# EAGLE design brushless (EAGLE 6.1)

## Sheet 1 of 5
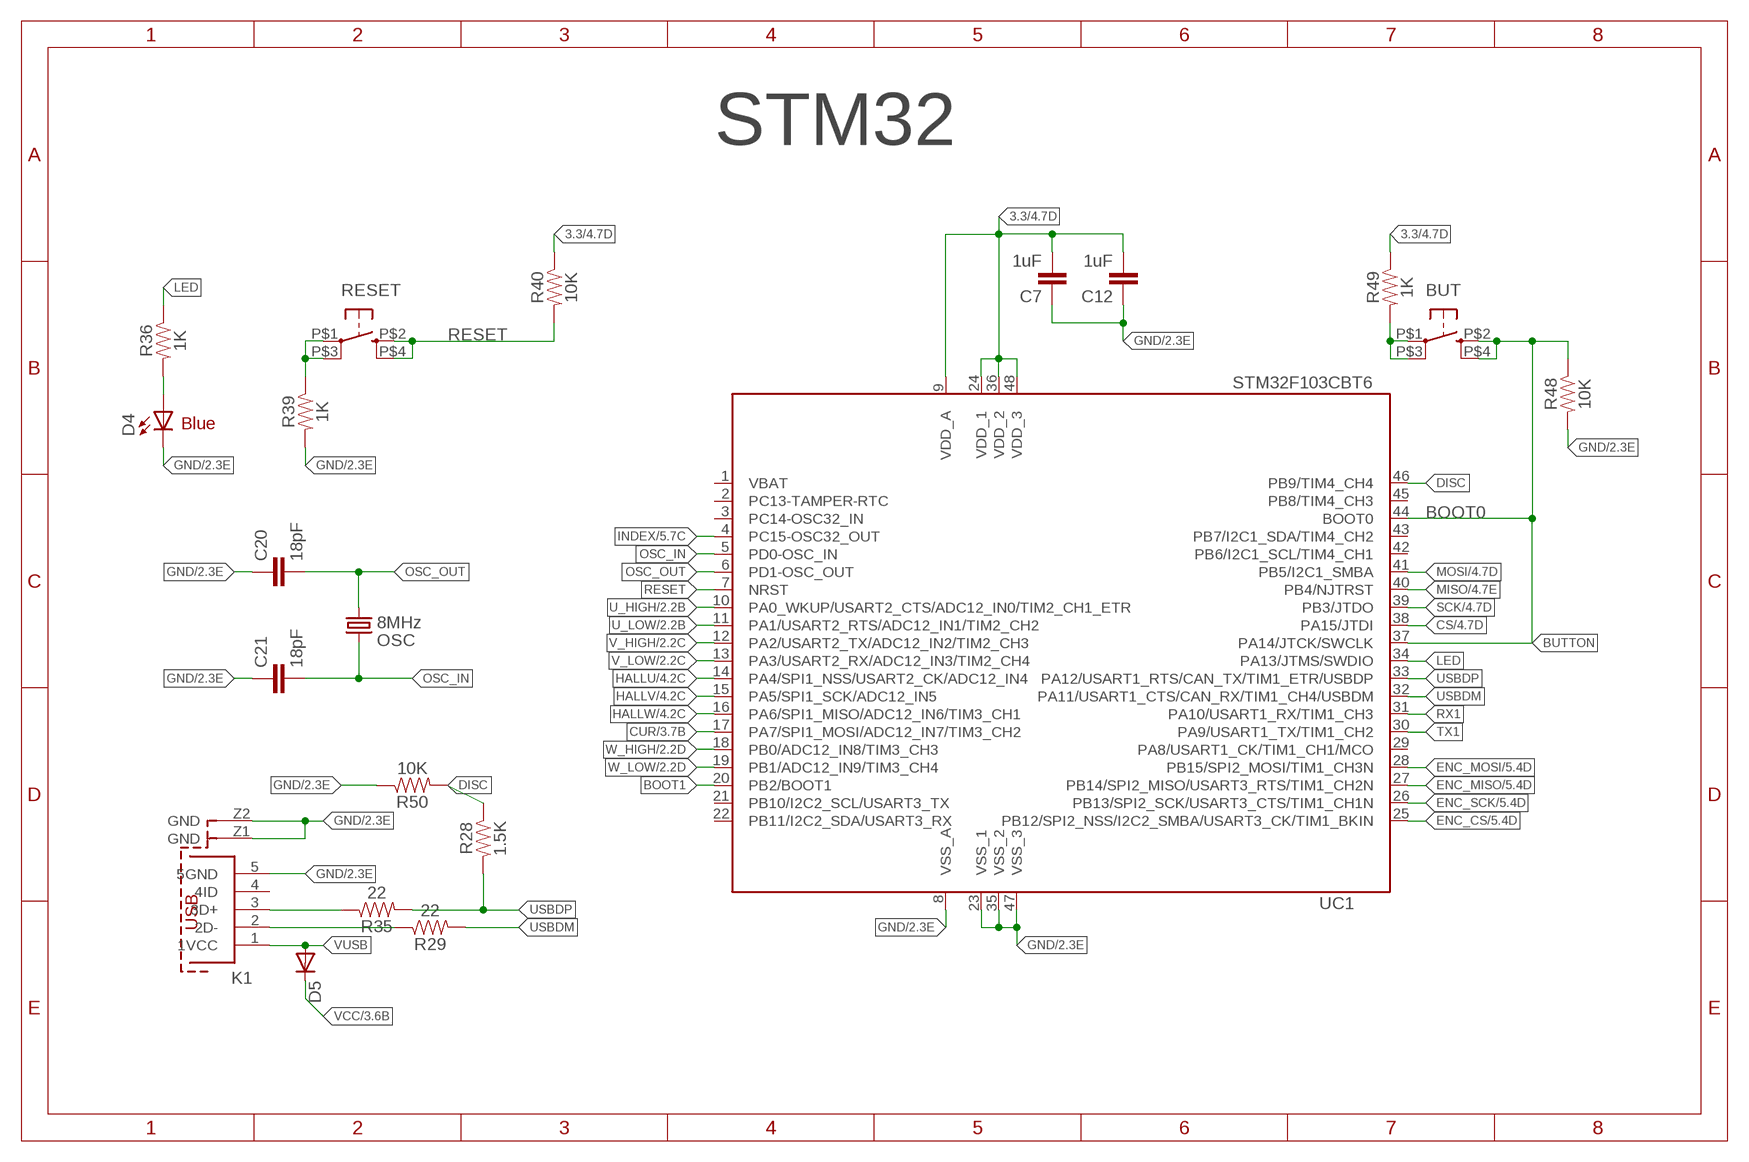
[diagram p0: schematic, sheet 1]

### Parts
BUT  KMR211GLFS  BUTTON-KMR241GLFS  [PUSHBUTTON-KMR241GLFS]
C7  1uF  CAP0805  [0805@1]
C12  1uF  CAP0805  [0805@1]
C20  18pF  CAP0805  [0805@1]
C21  18pF  CAP0805  [0805@1]
D4  Blue  LED1206  [LED-1206]
D5  DIODESOD  [SOD-323]
K1  614105150721  [614105150721]
OSC  8MHz  CRYSTAL5X3  [CRYSTAL-SMD-5X3]
R28  1.5K  RESISTOR0805  [0805]
R29  22  RESISTOR0805  [0805]
R35  22  RESISTOR0805  [0805]
R36  1K  RESISTOR0805  [0805]
R39  1K  RESISTOR0805  [0805]
R40  10K  RESISTOR0805  [0805]
R48  10K  RESISTOR0805  [0805]
R49  1K  RESISTOR0805  [0805]
R50  10K  RESISTOR0805  [0805]
RESET  KMR211GLFS  BUTTON-KMR241GLFS  [PUSHBUTTON-KMR241GLFS]
UC1  STM32F103CBT6  STM32F103CB  [LQFP48]

### Nets
3.3: C7.2 C12.2 R40.1 R49.1 UC1.9(VDD_A) UC1.24(VDD_1) UC1.36(VDD_2) UC1.48(VDD_3) ; also sheet 4
BOOT1: UC1.20(PB2/BOOT1)
BUTTON: BUT.P$2 BUT.P$4 R48.1 UC1.37(PA14/JTCK/SWCLK) UC1.44(BOOT0)
CS: UC1.38(PA15/JTDI) ; also sheet 4
CUR: UC1.17(PA7/SPI1_MOSI/ADC12_IN7/TIM3_CH2) ; also sheet 3
DISC: R28.1 R50.2 UC1.46(PB9/TIM4_CH4)
ENC_CS: UC1.25(PB12/SPI2_NSS/I2C2_SMBA/USART3_CK/TIM1_BKIN) ; also sheet 5
ENC_MISO: UC1.27(PB14/SPI2_MISO/USART3_RTS/TIM1_CH2N) ; also sheet 5
ENC_MOSI: UC1.28(PB15/SPI2_MOSI/TIM1_CH3N) ; also sheet 5
ENC_SCK: UC1.26(PB13/SPI2_SCK/USART3_CTS/TIM1_CH1N) ; also sheet 5
GND [power]: C7.1 C12.1 C20.1 C21.1 D4.C K1.5(5GND) K1.Z1(GND) K1.Z2(GND) R39.2 R48.2 R50.1 UC1.8(VSS_A) UC1.23(VSS_1) UC1.35(VSS_2) UC1.47(VSS_3) ; also sheet 2,3,4,5
HALLU: UC1.14(PA4/SPI1_NSS/USART2_CK/ADC12_IN4) ; also sheet 4
HALLV: UC1.15(PA5/SPI1_SCK/ADC12_IN5) ; also sheet 4
HALLW: UC1.16(PA6/SPI1_MISO/ADC12_IN6/TIM3_CH1) ; also sheet 4
INDEX: UC1.4(PC15-OSC32_OUT) ; also sheet 5
LED: R36.1 UC1.34(PA13/JTMS/SWDIO)
MISO: UC1.40(PB4/NJTRST) ; also sheet 4
MOSI: UC1.41(PB5/I2C1_SMBA) ; also sheet 4
N$19: R39.1 RESET.P$1 RESET.P$3
N$26: BUT.P$1 BUT.P$3 R49.2
N$29: D4.A R36.2
N$59: K1.2(2D-) R29.1
N$60: K1.3(3D+) R35.1
OSC_IN: C21.2 OSC.3 UC1.5(PD0-OSC_IN)
OSC_OUT: C20.2 OSC.1 UC1.6(PD1-OSC_OUT)
RESET: R40.2 RESET.P$2 RESET.P$4 UC1.7(NRST)
RX1: UC1.31(PA10/USART1_RX/TIM1_CH3)
SCK: UC1.39(PB3/JTDO) ; also sheet 4
TX1: UC1.30(PA9/USART1_TX/TIM1_CH2)
U_HIGH: UC1.10(PA0_WKUP/USART2_CTS/ADC12_IN0/TIM2_CH1_ETR) ; also sheet 2
U_LOW: UC1.11(PA1/USART2_RTS/ADC12_IN1/TIM2_CH2) ; also sheet 2
USBDM: R29.2 UC1.32(PA11/USART1_CTS/CAN_RX/TIM1_CH4/USBDM)
USBDP: R28.2 R35.2 UC1.33(PA12/USART1_RTS/CAN_TX/TIM1_ETR/USBDP)
V_HIGH: UC1.12(PA2/USART2_TX/ADC12_IN2/TIM2_CH3) ; also sheet 2
V_LOW: UC1.13(PA3/USART2_RX/ADC12_IN3/TIM2_CH4) ; also sheet 2
VCC: D5.1(C) ; also sheet 3,4,5
VUSB: D5.2(A) K1.1(1VCC)
W_HIGH: UC1.18(PB0/ADC12_IN8/TIM3_CH3) ; also sheet 2
W_LOW: UC1.19(PB1/ADC12_IN9/TIM3_CH4) ; also sheet 2
Unconnected: K1.4(4ID) UC1.2(PC13-TAMPER-RTC) UC1.3(PC14-OSC32_IN) UC1.21(PB10/I2C2_SCL/USART3_TX) UC1.22(PB11/I2C2_SDA/USART3_RX) UC1.29(PA8/USART1_CK/TIM1_CH1/MCO) UC1.42(PB6/I2C1_SCL/TIM4_CH1) UC1.43(PB7/I2C1_SDA/TIM4_CH2) UC1.45(PB8/TIM4_CH3)

### Notes on the sheet
- STM32
- Blue
- BOOT0

## Sheet 2 of 5
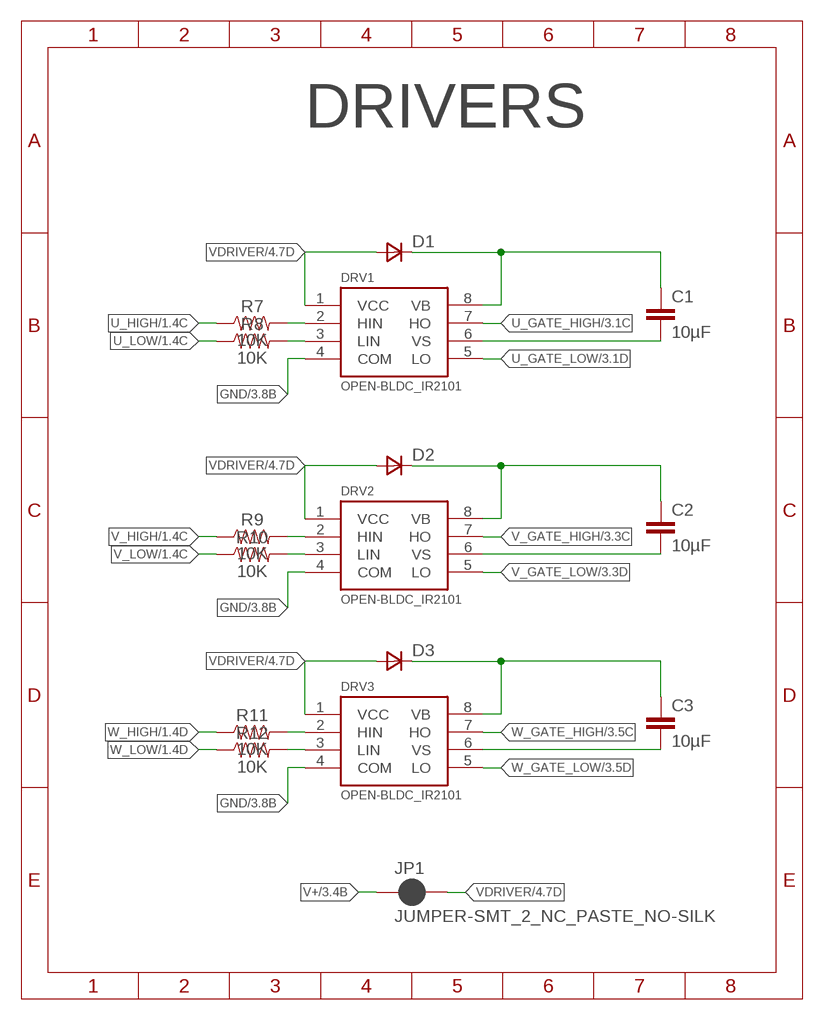
[diagram p1: schematic, sheet 2]

### Parts
C1  10µF  0.33UF/330NF-0805-50V-10%  [0805]
C2  10µF  0.33UF/330NF-0805-50V-10%  [0805]
C3  10µF  0.33UF/330NF-0805-50V-10%  [0805]
D1  ZETEX_VAR2SOT23  [ZETEX_SOT-23]
D2  ZETEX_VAR2SOT23  [ZETEX_SOT-23]
D3  ZETEX_VAR2SOT23  [ZETEX_SOT-23]
DRV1  OPEN-BLDC_IR2101  [OPEN-BLDC_SO-8]
DRV2  OPEN-BLDC_IR2101  [OPEN-BLDC_SO-8]
DRV3  OPEN-BLDC_IR2101  [OPEN-BLDC_SO-8]
JP1  JUMPER-SMT_2_NC_PASTE_NO-SILK  [SMT-JUMPER_2_NC_PASTE_NO-SILK]
R7  10K  RESISTOR0805  [0805]
R8  10K  RESISTOR0805  [0805]
R9  10K  RESISTOR0805  [0805]
R10  10K  RESISTOR0805  [0805]
R11  10K  RESISTOR0805  [0805]
R12  10K  RESISTOR0805  [0805]

### Nets
GND [power]: DRV1.4(COM) DRV2.4(COM) DRV3.4(COM) ; also sheet 1,3,4,5
N$4: DRV1.2(HIN) R7.2
N$5: C1.1 D1.1(C) DRV1.8(VB)
N$8: DRV1.3(LIN) R8.2
N$10: C2.1 D2.1(C) DRV2.8(VB)
N$11: C1.2 DRV1.6(VS)
N$12: DRV2.2(HIN) R9.2
N$13: DRV2.3(LIN) R10.2
N$14: C2.2 DRV2.6(VS)
N$15: C3.1 D3.1(C) DRV3.8(VB)
N$16: DRV3.2(HIN) R11.2
N$17: DRV3.3(LIN) R12.2
N$18: C3.2 DRV3.6(VS)
U_GATE_HIGH: DRV1.7(HO) ; also sheet 3
U_GATE_LOW: DRV1.5(LO) ; also sheet 3
U_HIGH: R7.1 ; also sheet 1
U_LOW: R8.1 ; also sheet 1
V+ [vdriver]: JP1.1 ; also sheet 3,4
V_GATE_HIGH: DRV2.7(HO) ; also sheet 3
V_GATE_LOW: DRV2.5(LO) ; also sheet 3
V_HIGH: R9.1 ; also sheet 1
V_LOW: R10.1 ; also sheet 1
VDRIVER [vdriver]: D1.3(A) D2.3(A) D3.3(A) DRV1.1(VCC) DRV2.1(VCC) DRV3.1(VCC) JP1.2 ; also sheet 4
W_GATE_HIGH: DRV3.7(HO) ; also sheet 3
W_GATE_LOW: DRV3.5(LO) ; also sheet 3
W_HIGH: R11.1 ; also sheet 1
W_LOW: R12.1 ; also sheet 1

### Notes on the sheet
- DRIVERS

## Sheet 3 of 5
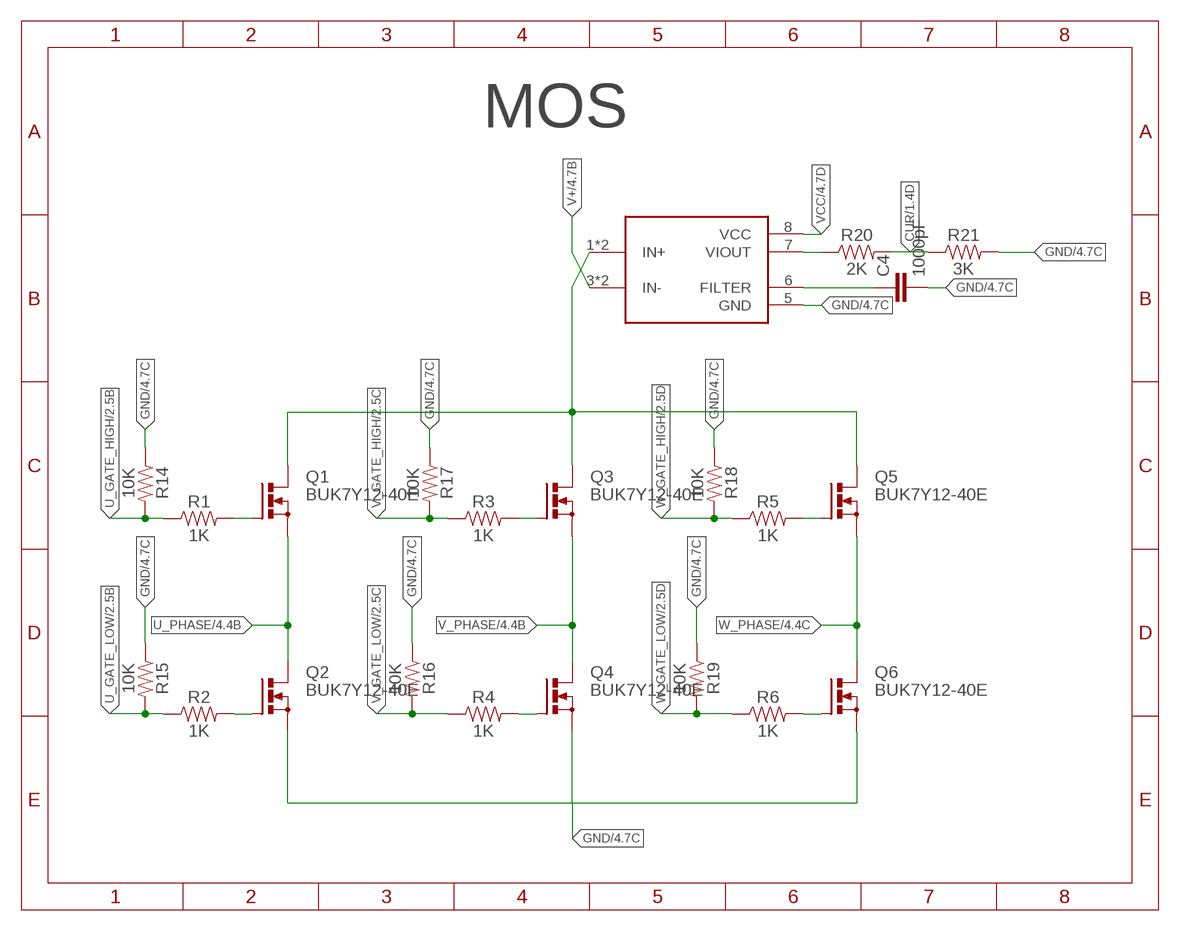
[diagram p2: schematic, sheet 3]

### Parts
C4  1000pF  CAP0805  [0805@1]
Q1  BUK7Y12-40E  [SOT669]
Q2  BUK7Y12-40E  [SOT669]
Q3  BUK7Y12-40E  [SOT669]
Q4  BUK7Y12-40E  [SOT669]
Q5  BUK7Y12-40E  [SOT669]
Q6  BUK7Y12-40E  [SOT669]
R1  1K  RESISTOR0805  [0805]
R2  1K  RESISTOR0805  [0805]
R3  1K  RESISTOR0805  [0805]
R4  1K  RESISTOR0805  [0805]
R5  1K  RESISTOR0805  [0805]
R6  1K  RESISTOR0805  [0805]
R14  10K  RESISTOR0805  [0805]
R15  10K  RESISTOR0805  [0805]
R16  10K  RESISTOR0805  [0805]
R17  10K  RESISTOR0805  [0805]
R18  10K  RESISTOR0805  [0805]
R19  10K  RESISTOR0805  [0805]
R20  2K  RESISTOR0805  [0805]
R21  3K  RESISTOR0805  [0805]
SENSE  ACS712  [SO8]

### Nets
CUR: R20.2 R21.1 ; also sheet 1
GND [power]: C4.2 Q2.1(S) Q2.2(S) Q2.3(S) Q4.1(S) Q4.2(S) Q4.3(S) Q6.1(S) Q6.2(S) Q6.3(S) R14.1 R15.1 R16.1 R17.1 R18.1 R19.1 R21.2 SENSE.5(GND) ; also sheet 1,2,4,5
N$1: Q1.4(G) R1.2
N$2: Q3.4(G) R3.2
N$3: Q2.4(G) R2.2
N$6: Q4.4(G) R4.2
N$7: Q5.4(G) R5.2
N$9: Q6.4(G) R6.2
N$24: R20.1 SENSE.7(VIOUT)
N$27: C4.1 SENSE.6(FILTER)
U_GATE_HIGH: R1.1 R14.2 ; also sheet 2
U_GATE_LOW: R2.1 R15.2 ; also sheet 2
U_PHASE [power]: Q1.1(S) Q1.2(S) Q1.3(S) Q2.MB(D) ; also sheet 4
V+ [vdriver]: SENSE.3(IN-) SENSE.4(IN-) ; also sheet 2,4
V+_MOS [power]: Q1.MB(D) Q3.MB(D) Q5.MB(D) SENSE.1(IN+) SENSE.2(IN+)
V_GATE_HIGH: R3.1 R17.2 ; also sheet 2
V_GATE_LOW: R4.1 R16.2 ; also sheet 2
V_PHASE [power]: Q3.1(S) Q3.2(S) Q3.3(S) Q4.MB(D) ; also sheet 4
VCC: SENSE.8(VCC) ; also sheet 1,4,5
W_GATE_HIGH: R5.1 R18.2 ; also sheet 2
W_GATE_LOW: R6.1 R19.2 ; also sheet 2
W_PHASE [power]: Q5.1(S) Q5.2(S) Q5.3(S) Q6.MB(D) ; also sheet 4

### Notes on the sheet
- MOS

## Sheet 4 of 5
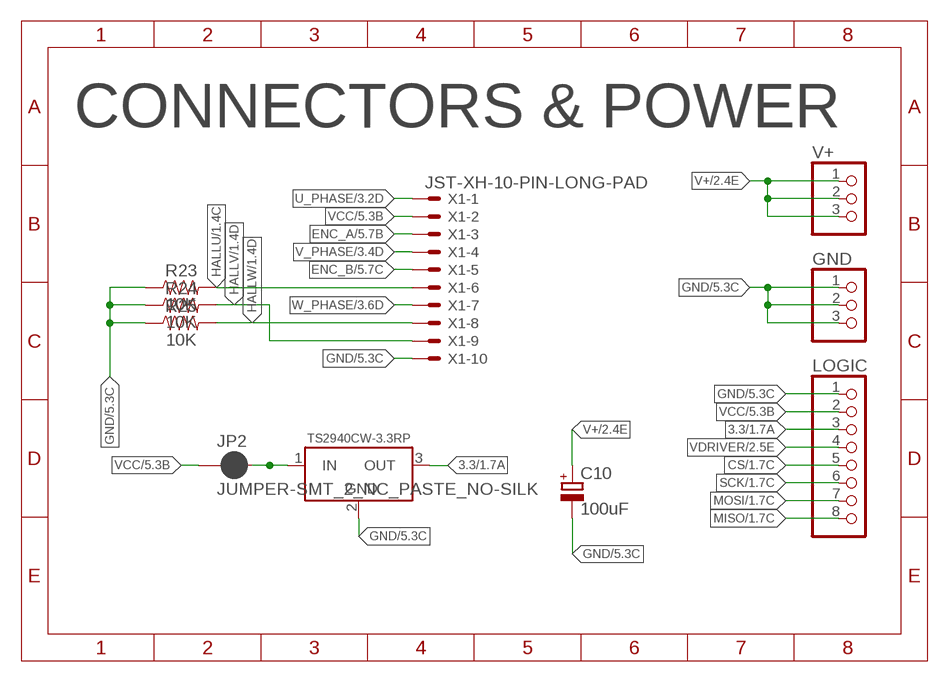
[diagram p3: schematic, sheet 4]

### Parts
C10  100uF  CPOL_EU_3.5-8  [E3,5-8]
GND  CONNEC_1X03  [CONNEC_1X03]
JP2  JUMPER-SMT_2_NC_PASTE_NO-SILK  [SMT-JUMPER_2_NC_PASTE_NO-SILK]
LOGIC  CONNEC_1X08  [CONNEC_1X08]
R23  10K  RESISTOR0805  [0805]
R24  10K  RESISTOR0805  [0805]
R25  10K  RESISTOR0805  [0805]
REG1  TS2940CW-3.3RP  [SOT223]
V+  CONNEC_1X03  [CONNEC_1X03]
X1  JST-XH-10-PIN-LONG-PAD  [JST-XH-10-PACKAGE-LONG-PAD]

### Nets
3.3: LOGIC.3 REG1.3(OUT) ; also sheet 1
CS: LOGIC.5 ; also sheet 1
ENC_A: X1.3 ; also sheet 5
ENC_B: X1.5 ; also sheet 5
GND [power]: C10.- GND.1 GND.2 GND.3 LOGIC.1 R23.1 R24.1 R25.1 REG1.2(GND) X1.10 ; also sheet 1,2,3,5
HALLU: R23.2 X1.6 ; also sheet 1
HALLV: R24.2 X1.9 ; also sheet 1
HALLW: R25.2 X1.8 ; also sheet 1
MISO: LOGIC.8 ; also sheet 1
MOSI: LOGIC.7 ; also sheet 1
N$22: JP2.2 REG1.1(IN)
SCK: LOGIC.6 ; also sheet 1
U_PHASE [power]: X1.1 ; also sheet 3
V+ [vdriver]: C10.+ V+.1 V+.2 V+.3 ; also sheet 2,3
V_PHASE [power]: X1.4 ; also sheet 3
VCC: JP2.1 LOGIC.2 X1.2 ; also sheet 1,3,5
VDRIVER [vdriver]: LOGIC.4 ; also sheet 2
W_PHASE [power]: X1.7 ; also sheet 3

### Notes on the sheet
- CONNECTORS & POWER

## Sheet 5 of 5
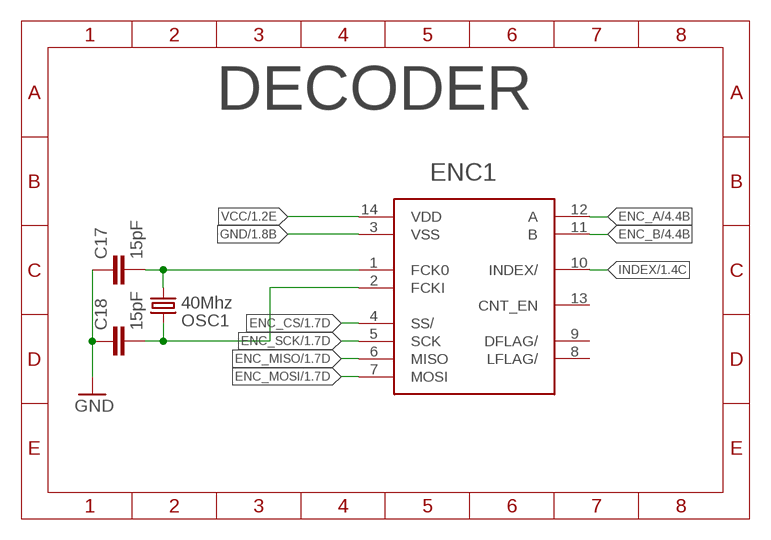
[diagram p4: schematic, sheet 5]

### Parts
C17  15pF  C_EU_22PF  [C0603]
C18  15pF  C_EU_22PF  [C0603]
ENC1  LS7366RSO14  [SO14]
OSC1  40Mhz  CRYSTAL5X3  [CRYSTAL-SMD-5X3]

### Nets
ENC_A: ENC1.12(A) ; also sheet 4
ENC_B: ENC1.11(B) ; also sheet 4
ENC_CS: ENC1.4(SS/) ; also sheet 1
ENC_MISO: ENC1.6(MISO) ; also sheet 1
ENC_MOSI: ENC1.7(MOSI) ; also sheet 1
ENC_SCK: ENC1.5(SCK) ; also sheet 1
GND [power]: C17.1 C18.1 ENC1.3(VSS) ; also sheet 1,2,3,4
INDEX: ENC1.10(INDEX/) ; also sheet 1
N$20: C17.2 ENC1.1(FCK0) OSC1.1
N$21: C18.2 ENC1.2(FCKI) OSC1.3
VCC: ENC1.14(VDD) ; also sheet 1,3,4
Unconnected: ENC1.8(LFLAG/) ENC1.9(DFLAG/) ENC1.13(CNT_EN)

### Notes on the sheet
- DECODER

## Power pins joined to a net without a drawn wire
VBAT: UC1.1(VBAT)

## Library data of the parts
BUT RESET = okie:BUTTON-KMR241GLFS; FARNELL: 1437637
C1-C3 = SparkFun-Capacitors:0.33UF/330NF: 0.33µF/330nF ceramic capacitors A capacitor is a passive two-terminal electrical component used to store electrical energy temporarily in an electric field.; FARNELL: 2528772; PROD_ID: CAP-08469; VALUE: 0.33µF
C4 = SparkFun-Passives:CAP: Capacitor Standard 0603 ceramic capacitor, and 0.1" leaded capacitor.; FARNELL: 2496935
C7 C12 = SparkFun-Passives:CAP: Capacitor Standard 0603 ceramic capacitor, and 0.1" leaded capacitor.; FARNELL: 2496946
C10 = rhoban:CPOL_EU: 47uF: http://fr.farnell.com/panasonic-electronic-components/eee1ca470sp/condensateur-elec-alu-47uf-16v/dp/9696946 220uF: http://fr.farnell.com/panasonic-electronic-components/eeefk1c221xp/condensateur-elec-alu-220uf-16v/dp/1850103; FARNELL: 1144713
C17 C18 = rhoban:C_EU: non polarised condo; FARNELL: 721980
C20 C21 = SparkFun-Passives:CAP: Capacitor Standard 0603 ceramic capacitor, and 0.1" leaded capacitor.; FARNELL: 1414620
D1-D3 = rhoban:ZETEX_VAR2SOT23: DIODE; FARNELL: 2317446
D4 = SparkFun:LED: LEDs Standard schematic elements and footprints for 5mm, 3mm, 1206, and 0603 sized LEDs. 5mm - Spark Fun Electronics SKU : COM-00529 (and others); FARNELL: 1581233
D5 = SparkFun-DiscreteSemi:DIODE: Diode These are standard reverse protection diodes and small signal diodes. SMA package can handle up to about 1A. SOD-323 can handle about 200mA. What the SOD-323 package when ordering, there are some mfgs out there that are 5-pin packages.; FARNELL: 8737843RL
DRV1-DRV3 = rhoban:OPEN-BLDC_IR2101; FARNELL: 2296000
ENC1 = rhoban:LS7366R; FARNELL: -
GND V+ = rhoban:CONNEC_1X03; FARNELL: 1022248
JP1 JP2 = SparkFun-Jumpers:JUMPER-SMT_2_NC_PASTE: Normally closed solder jumper This jumper has an aperture in the stencil to allow solder paste to bridge the split in the wire so it's normally closed (NC). Wick off the solder to open the connection. Reapply solder to reclose the connection.; FARNELL: -
K1 = rhoban:614105150721: WR-COM_USB_Micro Type B_Vertical_THT; Micro Type B Vertical THT- Tape & Reel not for Pick & Place machine Code : Con_I-O_COM_USB_2.0_B_614105150721_614105150721 <http://katalog.we-online.de/media/images/eican/Con_I-O_COM_USB_2.0_B_614105150721_pf2.jpg> Details see: http://katalog.we-online.de/em/datasheet/614105150721.pdf Created 12/08/2014, Dan Xu 2014 (C) Wurth Elektronik
LOGIC = rhoban:CONNEC_1X08; FARNELL: 1022256
OSC = SparkFun2:CRYSTAL: Crystals Various standard crystals. Proven footprints. Spark Fun Electronics SKU : COM-00534; FARNELL: 2467818
OSC1 = SparkFun2:CRYSTAL: Crystals Various standard crystals. Proven footprints. Spark Fun Electronics SKU : COM-00534; FARNELL: 1842013
Q1-Q6 = transistor-power:BUK7Y12-40E; FARNELL: 2319916
R1-R6 R36 R39 R49 = SparkFun-Resistors:RESISTOR: Generic Resistor Package; FARNELL: 2446904
R7-R12 R14-R19 R23-R25 R40 R48 R50 = SparkFun-Resistors:RESISTOR: Generic Resistor Package; FARNELL: 2447553
R20 = SparkFun-Resistors:RESISTOR: Generic Resistor Package; FARNELL: 2446939
R21 = SparkFun-Resistors:RESISTOR: Generic Resistor Package; FARNELL: 2446965
R28 = SparkFun-Resistors:RESISTOR: Generic Resistor Package; FARNELL: 2446909
R29 R35 = SparkFun-Resistors:RESISTOR: Generic Resistor Package; FARNELL: 2446926
REG1 = rhoban:TS2940CW-3.3RP; FARNELL: 7261403
SENSE = rhoban:ACS712; FARNELL: 1329624
UC1 = stm32:STM32F103CB; FARNELL: 1606327
X1 = Rembrandt Electronics - JST XH Connectors v1-0:JST-XH-10-PIN: JST XH Connector 2 Pin Wire to board connector. Pitch: 2,54 mm, (0.100") Number of pins: 10 Created by Rembrandt Electronics www.rembrandtelectronics.com; FARNELL: -

## Net classes
1 vdriver: width 0.254 mm

## Board
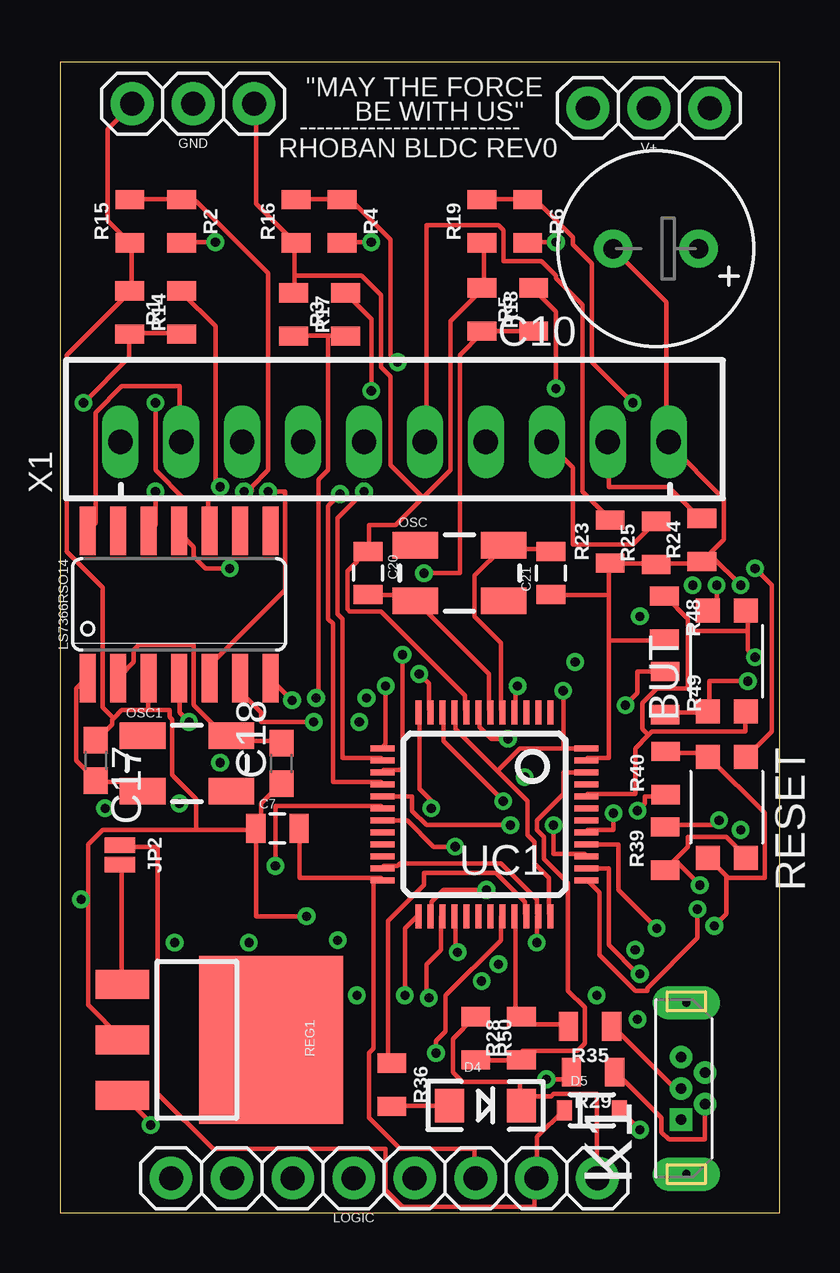
[diagram p5: board, top side]
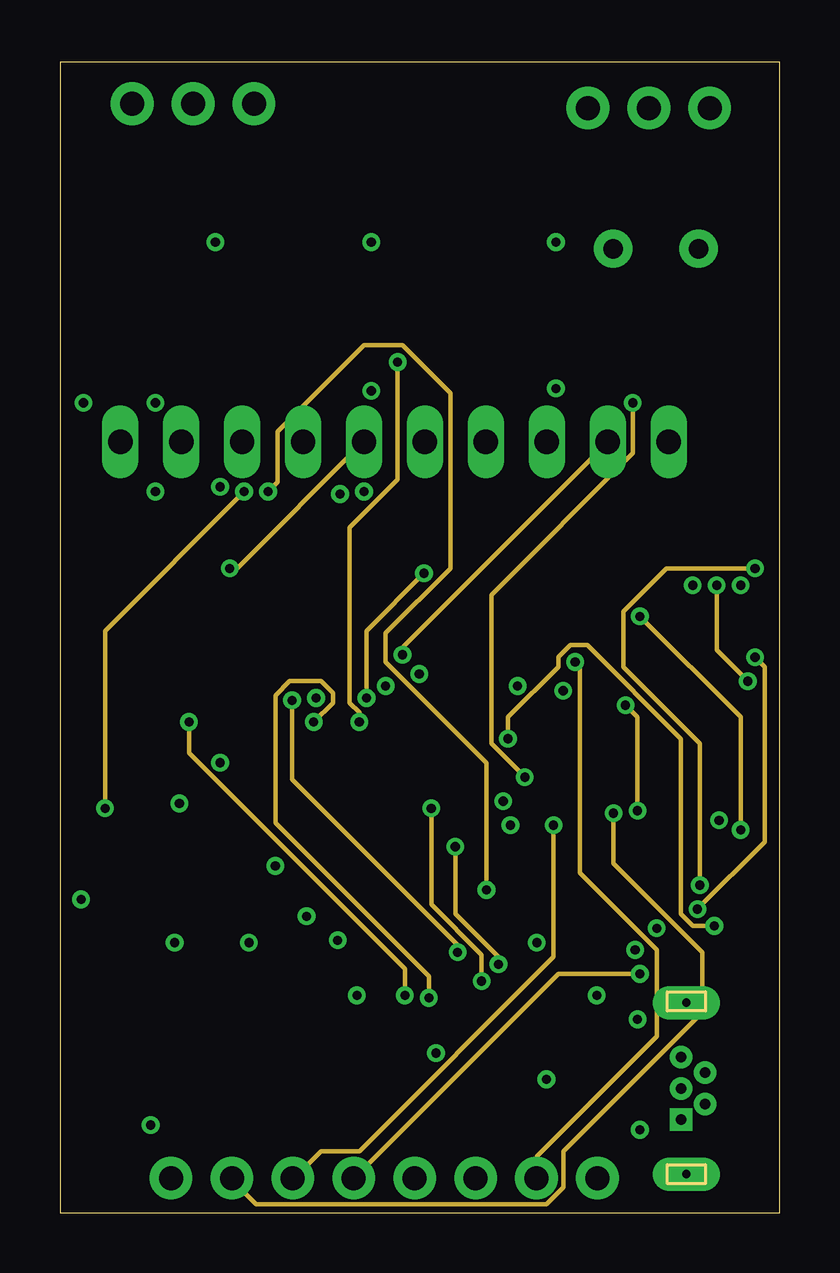
[diagram p6: board, inner layer Route2]
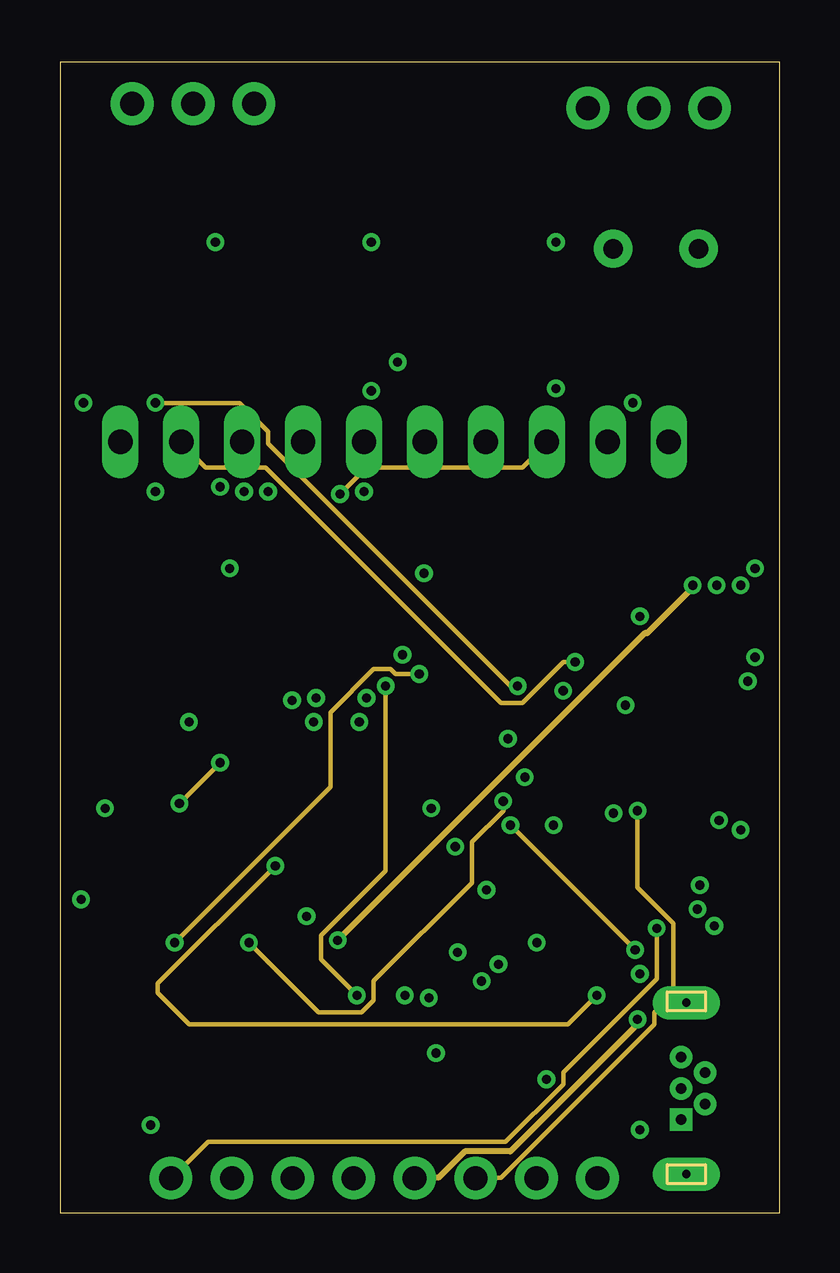
[diagram p7: board, inner layer Route15]
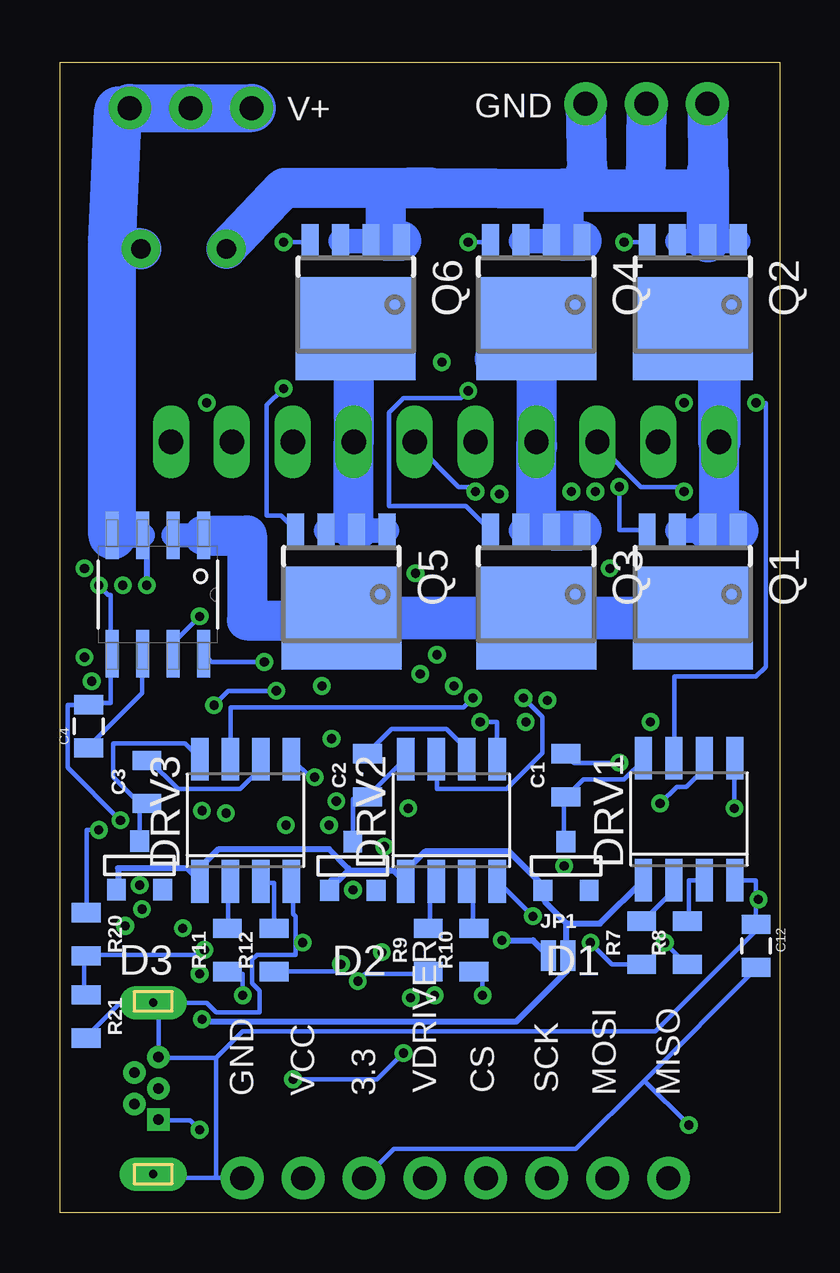
[diagram p8: board, bottom side, seen from below]

Size 30 x 47.97 mm. Coordinates in mm from the lower left corner, seen from the top.
Outline: 0,0 30,0 30,47.97 0,47.97 0,0
Copper layers (1*2*15*16): Top 0.035559375mm / dielectric 0.47751875mm / Route2 0.035559375mm / dielectric 0.47751875mm / Route15 0.035559375mm / dielectric 0.47751875mm / Bottom 0.035559375mm
Design rules: minimum track width 7mil, minimum drill 15mil, track to track 7mil, track to pad 7mil, pad to pad 7mil, via to via 7mil, smd to smd 7mil, copper to edge 7mil, drill to drill 7mil, minimum pad ring 7mil, minimum via ring 7mil, stop-mask expansion 4mil, vias tented up to drill 25mil, thermal gap 10mil

### Footprints (pad centres in the part's own frame; a part is rotated, then mirrored left to right if it is on the bottom)
PUSHBUTTON-KMR241GLFS = smd 1 x 1: P$1 2.1,0.8; P$2 2.1,-0.8; P$3 -2.1,0.8; P$4 -2.1,-0.8
0805 = smd 0.8 x 1.2: 1 -0.9,0; 2 0.9,0
0805@1 = smd 0.8 x 1.2: 1 -0.9,0; 2 0.9,0
E3,5-8 = drill 0.813 pad 1.6: + -1.778,0; - 1.778,0
C0603 = smd 1.1 x 1: 1 -0.85,0; 2 0.85,0
ZETEX_SOT-23 = smd 0.787 x 0.889: 1 0.025,-1.016; 2 -0.94,1.016; 3 0.991,1.016
LED-1206 = smd 1.2 x 1.4: A -1.5,0; C 1.5,0
SOD-323 = smd 0.63 x 0.83: 1 -1.15,0; 2 1.15,0
OPEN-BLDC_SO-8 = smd 0.72 x 1.78: 1 -1.905,-2.543; 2 -0.635,-2.543; 3 0.635,-2.543; 4 1.905,-2.543; 5 1.905,2.543; 6 0.635,2.543; 7 -0.635,2.543; 8 -1.905,2.543
SO14 = smd 0.66 x 2.032: 1 -3.81,-3.073; 2 -2.54,-3.073; 3 -1.27,-3.073; 4 0,-3.073; 5 1.27,-3.073; 6 2.54,-3.073; 7 3.81,-3.073; 8 3.81,3.073; 9 2.54,3.073; 10 1.27,3.073; 11 0,3.073; 12 -1.27,3.073; 13 -2.54,3.073; 14 -3.81,3.073
CONNEC_1X03 = drill 1 pad 1.778: 1 -1.27,1.27; 2 1.27,1.27; 3 3.81,1.27
SMT-JUMPER_2_NC_PASTE_NO-SILK = smd 0.635 x 1.27: 1 -0.406,0; 2 0.406,0
614105150721 = drill 0.44 pad 0.94 square: 1 2.275,0.22 | drill 0.44 pad 0.94: 2 2.925,-0.78; 3 3.575,0.22; 4 4.225,-0.78; 5 4.875,0.22 | drill 0.35 pad 1.4 long: Z1 0,0; Z2 7.15,0
CONNEC_1X08 = drill 1 pad 1.778: 1 -10.16,0; 2 -7.62,0; 3 -5.08,0; 4 -2.54,0; 5 0,0; 6 2.54,0; 7 5.08,0; 8 7.62,0
CRYSTAL-SMD-5X3 = smd 1.9 x 1.1: 1 -1.85,-1.15; 2 1.85,-1.15; 3 1.85,1.15; 4 -1.85,1.15
SOT669 = smd 0.7 x 1.4: 1 -1.905,-2.65; 2 -0.635,-2.65; 3 0.635,-2.65; 4 1.905,-2.65 | smd 5 x 4.3: MB 0,1
SOT223 = smd 1.219 x 2.235: 1 -2.311,-3.099; 2 0,-3.099; 3 2.311,-3.099 | smd 7 x 6: 4 0,3.099
SO8 = smd 1.981 x 0.533: 1 -2.464,1.905; 2 -2.464,0.635; 3 -2.464,-0.635; 4 -2.464,-1.905; 5 2.464,-1.905; 6 2.464,-0.635; 7 2.464,0.635; 8 2.464,1.905
LQFP48 = smd 0.254 x 1: 1 -2.75,-4.25; 2 -2.25,-4.25; 3 -1.75,-4.25; 4 -1.25,-4.25; 5 -0.75,-4.25; 6 -0.25,-4.25; 7 0.25,-4.25; 8 0.75,-4.25; 9 1.25,-4.25; 10 1.75,-4.25; 11 2.25,-4.25; 12 2.75,-4.25; 25 2.75,4.25; 26 2.25,4.25; 27 1.75,4.25; 28 1.25,4.25; 29 0.75,4.25; 30 0.25,4.25; 31 -0.25,4.25; 32 -0.75,4.25; 33 -1.25,4.25; 34 -1.75,4.25; 35 -2.25,4.25; 36 -2.75,4.25 | smd 1 x 0.254: 13 4.25,-2.75; 14 4.25,-2.25; 15 4.25,-1.75; 16 4.25,-1.25; 17 4.25,-0.75; 18 4.25,-0.25; 19 4.25,0.25; 20 4.25,0.75; 21 4.25,1.25; 22 4.25,1.75; 23 4.25,2.25; 24 4.25,2.75; 37 -4.25,2.75; 38 -4.25,2.25; 39 -4.25,1.75; 40 -4.25,1.25; 41 -4.25,0.75; 42 -4.25,0.25; 43 -4.25,-0.25; 44 -4.25,-0.75; 45 -4.25,-1.25; 46 -4.25,-1.75; 47 -4.25,-2.25; 48 -4.25,-2.75
JST-XH-10-PACKAGE-LONG-PAD = drill 1.016 long: 1 -11.43,0; 2 -8.89,0; 3 -6.35,0; 4 -3.81,0; 5 -1.27,0; 6 1.27,0; 7 3.81,0; 8 6.35,0; 9 8.89,0; 10 11.43,0

### Placement (x,y rotation side)
BUT  27.8,23 90 top
C1  8.9,18.25 90 bottom
C2  17.18,18.25 90 bottom
C3  26.38,17.97 90 bottom
C4  28.8,20.28 90 bottom
C7  1uF  [0805]  9.07,16.02 0 top
C10  24.84,40.19 180 top
C12  1uF  [0805]  0.98,11.14 270 bottom
C17  1.49,18.86 270 top
C18  9.23,18.74 90 top
C20  18pF  [0805]  12.85,26.68 270 top
C21  18pF  [0805]  20.47,26.68 90 top
D1  8.88,14.46 180 bottom
D2  17.77,14.46 180 bottom
D3  26.66,14.49 180 bottom
D4  17.74,4.48 0 top
D5  22.18,4.29 0 top
DRV1  3.77,16.42 0 bottom
DRV2  13.68,16.37 0 bottom
DRV3  22.26,16.37 0 bottom
ENC1  4.97,25.37 0 top
GND  6.82,47.51 180 top
JP1  9.22,10.73 0 bottom
JP2  2.49,14.92 270 top
K1  26.11,1.62 90 top
LOGIC  12.25,1.46 180 top
OSC  16.66,26.68 0 top
OSC1  5.3,18.74 0 top
Q1  3.62,25.8 180 bottom
Q2  3.62,37.86 180 bottom
Q3  10.14,25.8 180 bottom
Q4  10.14,37.86 180 bottom
Q5  18.27,25.8 180 bottom
Q6  17.67,37.86 180 bottom
R1  5.07,37.53 90 top
R2  5.07,41.33 270 top
R3  11.9,37.46 90 top
R4  11.75,41.33 270 top
R5  19.75,37.66 90 top
R6  19.5,41.33 270 top
R7  5.75,11.26 90 bottom
R8  3.85,11.26 90 bottom
R9  14.64,10.96 90 bottom
R10  12.74,10.96 90 bottom
R11  23.02,10.96 90 bottom
R12  21.07,10.96 90 bottom
R14  2.91,37.53 270 top
R15  2.92,41.33 90 top
R16  9.85,41.33 90 top
R17  9.74,37.46 270 top
R18  17.59,37.66 270 top
R19  17.6,41.33 90 top
R20  28.91,11.62 270 bottom
R21  28.91,8.19 270 bottom
R23  22.94,27.99 90 top
R24  26.76,28.06 90 top
R25  24.85,27.93 90 top
R28  19.24,7.29 90 top
R29  22.22,5.87 180 top
R35  22.1,7.78 180 top
R36  13.84,5.35 270 top
R39  25.23,15.19 90 top
R40  25.25,18.34 90 top
R48  25.2,24.81 270 top
R49  25.23,21.67 270 top
R50  17.34,7.29 270 top
REG1  5.71,7.21 270 top
RESET  27.8,16.91 270 top
SENSE  25.91,25.78 270 bottom
UC1  17.7,16.62 180 top
V+  25.82,47.33 180 top
X1  13.95,32.15 0 top

### Tracks (layer width: path | path; a pad name or v marks a point on that pad's centre or on a via)
3.3  (via drill 0.38)
  Top 0.178: 18.23,18.42 16.48,20.17 16.48,20.87 UC1.9 | 18.23,18.42 19.48,17.17 19.48,15.77 19.78,15.47 19.78,14.57 20.38,13.97 20.38,12.47 UC1.36 | 20.98,19.37 19.18,19.37 18.23,18.42 | 20.98,19.37 21.88,19.37 UC1.48 | v23.58,21.17 24.08,21.67 24.08,22.57 25.18,22.57 R49.1 | 20.98,19.37 v20.98,21.77 | v24.08,16.77 24.38,17.07 24.38,17.37 25.18,17.37 R40.1 | 13.08,13.97 9.98,13.97 9.98,15.97 C7.2 | 13.08,13.97 13.38,13.97 UC1.24 13.08,13.97 | v3.78,3.67 3.78,3.77 2.68,4.87 REG1.3 | 13.08,13.97 13.08,6.87 12.88,6.67 12.88,3.97 14.18,2.67 17.28,2.67 17.28,1.47 LOGIC.3
  Route2 0.178: v24.08,16.77 24.08,20.67 v23.58,21.17
  Route15 0.178: v24.08,16.77 24.08,13.57 25.58,12.07 25.58,9.17 24.78,8.37 24.78,7.87 18.38,1.47 17.38,1.47 LOGIC.3
  Bottom 0.178: v23.58,21.17 22.98,21.77 v20.98,21.77 | 5.63,5.52 8.48,2.67 16.08,2.67 17.28,1.47 LOGIC.3 | 5.63,5.52 0.98,10.17 C12.2 | 5.63,5.52 v3.78,3.67
BUTTON  (via drill 0.38)
  Top 0.178: 24.53,19.92 24.68,20.07 28.58,20.07 28.58,20.87 BUT.P$4 | 24.53,19.92 23.98,19.37 23.98,17.47 21.98,17.47 UC1.44 | v26.58,12.67 26.58,11.47 24.48,9.37 24.48,9.27 23.98,9.27 22.48,10.77 22.48,13.37 21.98,13.87 UC1.37 | v28.98,23.17 28.68,23.47 28.68,24.27 | 28.68,24.27 28.68,25.07 BUT.P$2 | 26.23,24.42 26.38,24.27 28.68,24.27 | 26.23,24.42 26.18,24.47 26.18,24.77 25.28,25.67 R48.1 | 24.53,19.92 24.28,20.17 24.28,21.27 24.88,21.87 26.18,21.87 26.18,24.37 26.23,24.42
  Route2 0.178: v26.58,12.67 29.38,15.47 29.38,22.77 v28.98,23.17
CS  (via drill 0.38)
  Top 0.178: v24.18,9.97 24.08,9.97 22.88,11.17 22.88,14.37 21.98,14.37 UC1.38
  Route2 0.178: v24.18,9.97 20.78,9.97 12.28,1.47 LOGIC.5
CUR  (via drill 0.38)
  Top 0.178: v18.78,16.17 15.28,16.17 14.68,16.77 14.68,17.37 13.48,17.37 UC1.17
  Route15 0.178: v23.98,10.97 v18.78,16.17
  Bottom 0.178: v23.98,10.97 24.18,10.77 28.88,10.77 R20.2 28.98,10.67 28.98,9.17 R21.1
DISC
  Top 0.178: UC1.46 21.88,18.37 20.98,18.37 20.98,17.47 19.88,16.37 19.88,15.97 20.18,15.67 20.18,14.77 21.18,13.77 21.18,9.27 21.88,8.57 21.88,7.07 21.58,6.77 19.28,6.77 19.28,6.47 R28.1 19.18,6.37 17.38,6.37 R50.2
ENC_A  (via drill 0.38)
  Top 0.178: v3.98,30.07 3.98,28.67 3.78,28.47 ENC1.12
  Bottom 0.178: v3.98,30.07 4.18,30.27 5.78,30.27 7.58,32.07 X1.3
ENC_B  (via drill 0.38)
  Top 0.178: v7.08,26.87 6.08,26.87 5.58,27.37 5.58,27.77 4.98,28.37 ENC1.11
  Route2 0.178: v7.08,26.87 7.38,26.87 12.58,32.07 X1.5
ENC_CS  (via drill 0.38)
  Top 0.178: v14.38,9.07 14.38,11.87 14.88,12.37 UC1.25 | v5.38,20.47 4.98,20.87 4.98,22.27 ENC1.4
  Route2 0.178: v14.38,9.07 14.38,10.17 5.38,19.17 v5.38,20.47
ENC_MISO  (via drill 0.38)
  Top 0.178: v15.38,8.97 15.28,9.07 15.28,10.37 15.88,10.97 15.88,12.37 UC1.27 | v10.58,20.47 8.38,20.47 8.38,20.87 7.58,21.67 7.58,22.27 ENC1.6
  Route2 0.178: v15.38,8.97 15.38,9.87 8.98,16.27 8.98,21.57 9.58,22.17 10.88,22.17 11.38,21.67 11.38,21.27 v10.58,20.47
ENC_MOSI  (via drill 0.38)
  Top 0.178: v16.58,10.87 16.48,10.97 16.48,12.37 UC1.28 | v9.68,21.37 8.78,22.27 ENC1.7
  Route2 0.178: v16.58,10.87 16.58,11.17 9.68,18.07 v9.68,21.37
ENC_SCK  (via drill 0.38)
  Top 0.178: v17.78,13.47 15.98,13.47 15.48,12.97 15.48,12.47 UC1.26 | v8.68,30.07 9.38,30.07 9.38,25.97 6.28,22.87 6.28,22.37 ENC1.5
  Route2 0.178: v17.78,13.47 17.78,18.77 13.58,22.97 13.58,24.17 16.28,26.87 16.28,34.17 14.28,36.17 12.68,36.17 9.08,32.57 9.08,30.47 v8.68,30.07
GND  (via drill 0.38)
  Top 0.178: 19.18,4.87 19.18,4.57 D4.C 19.18,4.87 | 19.18,4.87 19.18,5.47 16.78,5.47 16.38,5.87 16.38,7.27 17.28,8.17 R50.1 | 19.18,4.87 20.48,4.87 20.58,4.97 22.38,4.97 22.38,1.47 LOGIC.1 | UC1.23 13.48,14.47 14.08,14.47 14.18,14.57 18.38,14.57 19.88,13.07 19.88,12.47 UC1.35 19.88,12.37 v19.88,11.27 | 2.23,20.62 2.58,20.97 3.68,20.97 | 2.23,20.62 2.18,20.57 2.18,20.37 1.58,19.77 C17.1 | 3.68,20.97 3.68,22.27 ENC1.3 | C18.1 9.18,17.87 8.38,17.07 8.38,16.27 8.18,16.07 C7.1 | v10.28,12.37 8.18,12.37 8.18,15.97 C7.1 | 1.18,13.07 1.18,15.37 1.78,15.97 5.68,15.97 | 1.18,13.07 1.18,8.67 2.58,7.27 REG1.2 | 5.68,15.97 8.08,15.97 C7.1 | 1.18,13.07 v0.88,13.07 | 3.68,20.97 4.58,20.97 4.58,20.67 4.68,20.57 4.68,18.27 5.68,17.27 5.68,15.97 | R19.1 17.68,40.37 17.68,38.57 R18.1 17.58,38.47 16.28,37.17 16.28,30.97 15.13,29.82 | UC1.8 16.88,20.97 16.88,21.57 13.38,25.07 12.08,25.07 11.98,25.17 11.98,26.77 12.78,27.57 C20.1 12.88,27.67 12.88,28.67 13.98,28.67 15.13,29.82 | 9.78,39.07 9.78,40.37 R16.1 9.78,40.47 8.18,42.07 8.18,46.17 GND.1 | 9.78,39.07 9.78,38.37 R17.1 | GND.3 2.98,46.17 1.98,45.17 1.98,41.37 2.88,40.47 R15.1 2.98,40.37 2.98,38.47 R14.1 2.88,38.37 0.28,35.77 0.28,27.57 1.78,26.07 1.78,21.07 2.23,20.62 | v27.48,16.37 27.48,16.17 25.28,16.17 R39.2 | R24.1 26.68,27.07 24.88,27.07 R25.1 24.78,27.07 22.98,27.07 R23.1 22.88,27.07 22.88,25.77 | 22.88,25.77 22.88,23.87 | 22.88,23.87 22.88,18.97 21.98,18.97 UC1.47 | 22.88,25.77 C21.1 | 22.88,23.87 25.18,23.87 R48.2 | R24.1 26.78,27.17 27.68,28.07 27.68,29.77 25.38,32.07 X1.10 25.28,32.17 25.28,37.97 23.08,40.17 C10.- | v28.38,26.17 27.18,27.37 27.18,27.47 R24.1
  Top 0.178: 15.13,29.82 13.78,31.17 13.78,34.87 13.38,35.27 13.38,38.27 12.58,39.07 9.78,39.07
  Bottom 0.178: 23.48,1.47 22.48,1.47 LOGIC.1 | 23.48,1.47 25.98,1.47 26.08,1.57 K1.Z1 | R21.2 28.88,7.37 27.48,8.77 26.18,8.77 K1.Z2 | 20.18,11.27 20.18,10.77 21.78,10.77 21.98,10.57 21.98,9.57 21.68,9.27 21.68,8.37 23.48,8.37 23.88,8.77 25.88,8.77 | 20.18,11.27 20.18,12.37 20.28,12.47 20.28,13.77 DRV3.4 | 25.88,8.77 26.08,8.77 K1.Z2 | 25.88,8.77 25.88,6.57 K1.5 25.88,6.47 23.48,6.47 | 25.88,8.77 K1.Z2 | 20.18,11.27 v19.88,11.27 | 23.48,6.47 23.48,1.47 | 0.98,13.07 0.98,13.87 1.78,13.87 DRV1.4 | 0.98,13.07 0.98,12.07 C12.1 0.98,11.97 0.98,11.77 5.18,7.57 22.38,7.57 23.48,6.47 | v10.28,12.37 11.68,13.77 DRV2.4 | v0.88,13.07 0.98,13.07 | v27.48,16.37 29.68,18.57 29.68,21.17 28.88,21.17 C4.2 28.78,21.27 27.88,21.27 27.88,23.27 SENSE.5 27.88,23.37 27.88,25.77 27.98,25.77 v28.38,26.17
  Bottom 1.016: Q6.3 Q6.2 Q6.1 | Q4.3 Q4.2 Q4.1 | Q2.3 Q2.2 Q2.1
  Bottom 1.676: Q6.1 16.4,40.51 16.4,42.7 14.56,42.73 9,42.7 | 9,42.7 8.24,42.7 8.24,42.61 | GND.2 5.6,42.77 | GND.1 8.04,43.37 | GND.3 2.98,43.37 | Q4.1 9,40.51 9,42.7 | C10.- 20.65,42.73 15.45,42.73
  Bottom 1.7: 15.45,42.73 14.56,42.73
  Bottom 1.778: 8.24,42.61 5.6,42.61 | 5.6,42.61 2.98,42.61 | 2.98,42.61 Q2.2 | 5.6,42.77 5.6,42.61 | 8.04,43.37 8.24,42.7 | 2.98,43.37 2.98,42.61
HALLU  (via drill 0.38)
  Top 0.178: v12.68,30.07 11.58,28.97 11.58,24.97 11.78,24.77 11.78,18.97 13.38,18.97 UC1.14 | R23.2 22.88,28.97 21.78,30.07 21.78,37.87 20.68,38.97 20.68,39.07 20.08,39.67 18.48,39.67 18.48,40.97 18.28,41.17 15.28,41.17 15.28,32.17 X1.6
  Bottom 0.178: v12.68,30.07 12.88,30.27 13.38,30.27 15.18,32.07 X1.6
HALLV  (via drill 0.38)
  Top 0.178: v14.28,23.27 14.28,18.47 13.48,18.47 UC1.15 | R24.2 26.68,28.97 25.38,30.27 22.88,30.27 22.88,32.07 X1.9
  Route2 0.178: v14.28,23.27 14.28,23.57 22.78,32.07 X1.9
HALLW  (via drill 0.38)
  Top 0.178: v11.68,29.97 11.18,29.47 11.18,24.77 11.38,24.57 11.38,17.97 13.38,17.97 UC1.16 | R25.2 24.78,28.77 23.88,27.87 21.38,27.87 21.38,31.07 20.38,32.07 X1.8
  Route15 0.178: v11.68,29.97 12.78,31.07 19.28,31.07 20.28,32.07 X1.8
INDEX  (via drill 0.38)
  Top 0.178: v19.08,21.97 18.98,21.87 18.98,20.97 UC1.4 | v3.98,33.77 3.98,30.97 5.18,29.77 6.18,29.77 6.18,28.47 ENC1.10
  Route15 0.178: v19.08,21.97 18.78,21.97 8.68,32.07 8.68,32.57 7.48,33.77 v3.98,33.77
LED
  Top 0.178: UC1.34 19.38,12.47 19.38,12.97 18.18,14.17 15.18,14.17 15.18,13.67 13.68,12.17 13.68,6.37 13.78,6.27 R36.1
MISO  (via drill 0.38)
  Top 0.178: v24.88,11.87 23.28,13.47 23.28,15.37 21.98,15.37 UC1.40
  Route15 0.178: v24.88,11.87 24.88,9.77 20.98,5.87 20.98,5.37 18.58,2.97 6.18,2.97 4.68,1.47 LOGIC.8
MOSI  (via drill 0.38)
  Top 0.178: v23.08,16.67 23.08,15.97 21.98,15.97 UC1.41
  Route2 0.178: v23.08,16.67 23.08,14.57 26.78,10.87 26.78,8.37 20.98,2.57 20.98,1.07 20.28,0.37 8.18,0.37 7.18,1.37 LOGIC.7
N$1  (via drill 0.38)
  Top 0.178: v6.68,30.27 6.48,30.47 6.48,36.97 5.08,38.37 R1.2
  Bottom 0.178: v6.68,30.27 6.68,28.47 5.58,28.47 Q1.4
N$2  (via drill 0.38)
  Top 0.178: v12.98,34.27 12.98,37.27 11.98,38.27 R3.2
  Bottom 0.178: v12.98,34.27 13.28,33.97 15.68,33.97 16.28,33.37 16.28,29.47 13.08,29.47 12.08,28.47 Q3.4
N$3  (via drill 0.38)
  Top 0.178: v6.48,40.47 5.08,40.47 R2.2
  Bottom 0.178: v6.48,40.47 5.58,40.47 Q2.4
N$4
  Bottom 0.178: R7.2 5.68,12.17 4.48,13.37 4.48,13.87 DRV1.2
N$5
  Bottom 0.178: D1.1 8.98,15.57 8.98,17.27 C1.1 8.88,17.37 8.18,18.07 6.48,18.07 5.68,18.87 DRV1.8
N$6  (via drill 0.38)
  Top 0.178: v12.98,40.47 11.78,40.47 R4.2
  Bottom 0.178: v12.98,40.47 12.08,40.47 Q4.4
N$7  (via drill 0.38)
  Top 0.178: v20.68,34.37 20.68,37.57 19.78,38.47 R5.2
  Bottom 0.178: v20.68,34.37 21.38,33.67 21.38,29.07 20.78,29.07 20.18,28.47 Q5.4
N$8
  Bottom 0.178: R8.2 3.78,12.17 3.78,13.87 3.18,13.87 DRV1.3
N$9  (via drill 0.38)
  Top 0.178: v20.68,40.47 19.58,40.47 R6.2
  Bottom 0.178: v20.68,40.47 19.58,40.47 Q6.4
N$10
  Bottom 0.178: D2.1 17.78,15.57 17.78,17.27 17.28,17.27 C2.1 17.18,17.37 15.68,18.87 DRV2.8
N$11  (via drill 0.38)
  Route15 0.178: v4.98,17.07 v6.68,18.77
  Bottom 0.178: v6.68,18.77 8.58,18.77 8.88,19.07 C1.2 | v4.98,17.07 4.28,17.77 3.88,17.77 3.18,18.47 3.18,18.87 DRV1.6
N$12
  Bottom 0.178: R9.2 14.58,11.87 14.58,13.77 14.38,13.77 DRV2.2
N$13
  Bottom 0.178: R10.2 12.78,11.87 12.78,13.77 12.98,13.77 DRV2.3
N$14
  Bottom 0.178: C2.2 17.18,19.17 16.18,20.17 13.88,20.17 13.08,19.37 13.08,18.97 DRV2.6
N$15
  Bottom 0.178: 26.68,17.07 26.68,15.57 D3.1 | 26.68,17.07 C3.1 26.68,17.07 | 26.68,17.07 27.78,18.17 27.78,19.57 24.78,19.57 24.18,18.97 DRV3.8
N$16
  Bottom 0.178: R11.2 22.98,11.87 22.98,13.77 DRV3.2
N$17
  Bottom 0.178: R12.2 21.08,13.77 21.58,13.77 DRV3.3
N$18
  Bottom 0.178: C3.2 26.28,18.87 25.08,17.67 22.48,17.67 21.68,18.47 21.68,18.87 DRV3.6
N$19  (via drill 0.38)
  Top 0.178: RESET.P$1 28.58,14.87 27.78,15.67 26.18,15.67 26.18,15.27 25.28,14.37 R39.1 25.68,14.67 v26.68,13.67 | v28.98,26.87 29.68,26.17 29.68,20.07 28.68,19.07 RESET.P$3
  Route2 0.178: v28.98,26.87 25.28,26.87 23.48,25.07 23.48,22.77 26.68,19.57 v26.68,13.67
N$20
  Top 0.178: OSC1.1 3.38,17.67 3.38,17.97 1.58,17.97 C17.2 1.48,18.07 0.68,18.87 0.68,21.87 1.08,22.27 ENC1.1
N$21
  Top 0.178: C18.2 9.18,19.67 7.18,19.67 7.18,19.87 OSC1.3 7.08,19.97 6.78,19.97 5.58,21.17 5.58,23.67 3.28,23.67 3.08,23.47 3.08,22.97 2.48,22.37 ENC1.2
N$22
  Top 0.178: JP2.2 2.58,14.47 2.58,9.57 REG1.1
N$24  (via drill 0.38)
  Route2 0.178: v28.38,15.97 28.38,20.67 v24.18,24.87
  Bottom 0.178: v28.38,15.97 28.88,15.97 28.88,12.57 R20.1 | v24.18,24.87 25.28,23.77 SENSE.7
N$26  (via drill 0.38)
  Top 0.178: R49.2 25.28,20.87 26.98,20.87 BUT.P$3 27.08,20.97 27.08,22.17 v28.68,22.17 | v27.38,26.17 27.38,25.47 27.08,25.17 BUT.P$1
  Route2 0.178: v27.38,26.17 27.38,23.47 v28.68,22.17
N$27
  Bottom 0.178: C4.1 28.78,19.47 26.58,21.67 26.58,23.27 SENSE.6
N$29
  Top 0.178: R36.2 13.88,4.47 16.18,4.47 D4.A
N$59
  Top 0.178: R29.1 23.18,5.87 25.08,3.97 25.08,3.37 25.38,3.07 26.88,3.07 26.88,4.47 K1.2
N$60
  Top 0.178: R35.1 23.08,7.77 25.58,5.27 25.88,5.27 K1.3
OSC_IN
  Top 0.178: UC1.5 18.38,20.97 18.38,23.77 17.28,24.87 17.28,26.57 18.48,27.77 OSC.3 18.48,27.67 20.38,27.67 C21.2
OSC_OUT
  Top 0.178: UC1.6 17.88,20.97 17.88,22.47 14.88,25.47 OSC.1 14.78,25.57 14.78,25.77 12.88,25.77 C20.2
RESET  (via drill 0.38)
  Top 0.178: 27.83,14.02 27.88,13.97 29.38,13.97 29.38,16.67 27.08,18.97 RESET.P$4 26.98,19.07 26.98,19.17 25.28,19.17 R40.2 | 27.83,14.02 27.08,14.77 RESET.P$2 | v18.68,19.77 17.98,19.77 17.48,20.27 17.48,20.87 UC1.7 | v27.28,11.97 27.78,12.47 27.78,13.97 27.83,14.02
  Route2 0.178: v18.68,19.77 18.68,20.67 20.78,22.77 20.78,23.17 21.28,23.67 21.98,23.67 25.88,19.77 25.88,12.47 26.38,11.97 v27.28,11.97
SCK  (via drill 0.38)
  Top 0.178: v20.58,16.17 20.58,14.97 21.88,14.97 UC1.39
  Route2 0.178: v20.58,16.17 20.58,10.67 12.48,2.57 10.88,2.57 9.78,1.47 LOGIC.6
U_GATE_HIGH  (via drill 0.38)
  Top 0.178: R1.1 4.98,36.67 2.98,36.67 R14.2 2.88,36.57 2.88,35.67 v0.98,33.77
  Bottom 0.178: v0.98,33.77 0.58,33.77 0.58,22.77 0.98,22.37 4.38,22.37 4.38,18.97 DRV1.7
U_GATE_LOW  (via drill 0.38)
  Top 0.178: R15.2 2.98,42.27 4.98,42.27 R2.1 5.08,42.17 5.68,42.17 8.68,39.17 8.68,30.97 7.98,30.27 7.98,30.07 v7.68,30.07
  Route2 0.178: v1.88,16.87 1.88,24.27 v7.68,30.07
  Bottom 0.178: v1.88,16.87 1.88,18.87 DRV1.5
U_HIGH  (via drill 0.38)
  Top 0.178: v18.48,17.17 15.98,19.67 15.98,20.87 UC1.10
  Route15 0.178: v18.48,17.17 18.48,16.77 17.18,15.47 17.18,13.77 13.08,9.67 13.08,8.87 12.58,8.37 10.78,8.37 v7.88,11.27
  Bottom 0.178: v7.88,11.27 6.98,10.37 5.78,10.37 R7.1
U_LOW  (via drill 0.38)
  Top 0.178: v14.98,22.47 15.38,22.07 15.38,20.97 UC1.11
  Route15 0.178: v14.98,22.47 13.98,22.47 13.78,22.67 13.08,22.67 11.28,20.87 11.28,17.77 v4.78,11.27
  Bottom 0.178: v4.78,11.27 3.88,10.37 R8.1
U_PHASE
  Bottom 1.016: Q1.3 Q1.2
  Bottom 1.676: Q1.2 Q1.1 2.52,28.45 X1.1 | 2.52,35.56 Q2.MB
  Bottom 1.778: X1.1 2.52,35.56
USBDM  (via drill 0.38)
  Top 0.178: v15.68,6.67 15.68,7.17 16.08,7.57 16.08,9.07 18.38,11.37 18.38,12.37 UC1.32 | v20.28,5.57 21.28,5.57 21.28,5.87 R29.2
  Bottom 0.178: v15.68,6.67 16.78,5.57 v20.28,5.57
USBDP
  Top 0.178: UC1.33 18.98,12.37 18.98,8.47 19.18,8.27 R28.2 19.28,8.17 19.28,7.87 21.18,7.87 R35.2
V+  (via drill 0.38)
  Route15 0.254: v11.58,11.37 24.38,24.17 24.48,24.17 26.38,26.07 v26.38,26.17
  Bottom 0.254: v11.58,11.37 10.28,11.37 9.68,10.77 JP1.1 | v26.38,26.17 26.38,27.77 SENSE.3
  Bottom 1: SENSE.4 SENSE.3
  Bottom 1.7: C10.+ 27.57,40.19 27.82,40.45
  Bottom 2: V+.3 V+.2 V+.1 27.57,45.97 27.82,40.45 SENSE.4
V+_MOS
  Bottom 1: SENSE.1 SENSE.2
  Bottom 1.676: SENSE.1 22.2,28.24 22.2,24.7 18.27,24.7 Q5.MB
  Bottom 1.778: Q1.MB Q3.MB Q5.MB
V_GATE_HIGH  (via drill 0.38)
  Top 0.178: 11.18,36.57 11.88,36.57 R3.1 | 11.18,36.57 9.78,36.57 R17.2 | v10.68,21.47 10.78,21.57 10.78,30.57 11.18,30.97 11.18,36.57
  Bottom 0.178: v10.68,21.47 9.88,20.67 9.88,19.17 11.38,17.67 14.28,17.67 14.28,18.87 DRV2.7
V_GATE_LOW  (via drill 0.38)
  Top 0.178: R16.2 9.88,42.27 11.68,42.27 R4.1 11.78,42.17 12.18,42.17 13.78,40.57 13.78,35.77 v14.08,35.47
  Route2 0.178: v12.48,20.47 12.48,20.87 12.08,21.27 12.08,28.57 14.08,30.57 v14.08,35.47
  Bottom 0.178: v12.48,20.47 11.78,20.47 11.78,18.97 DRV2.5
V_HIGH  (via drill 0.38)
  Top 0.178: v15.48,16.87 15.48,17.17 14.98,17.67 14.98,20.87 UC1.12
  Route2 0.178: v15.48,16.87 15.48,12.87 17.58,10.77 v17.58,9.67
  Bottom 0.178: v17.58,9.67 17.28,9.97 14.68,9.97 R9.1
V_LOW  (via drill 0.38)
  Top 0.178: v13.58,21.97 13.58,19.57 13.48,19.47 UC1.13
  Route15 0.178: v13.58,21.97 13.58,14.27 10.88,11.57 10.88,10.57 v12.38,9.07
  Bottom 0.178: v12.38,9.07 12.38,9.97 12.68,9.97 R10.1
V_PHASE
  Bottom 1.016: Q3.2 Q3.3
  Bottom 1.676: Q4.MB 11.88,35.59 10.13,35.59 X1.4 | Q3.1 Q3.2 10.13,28.45 X1.4 | X1.4 10.11,31.95
VCC  (via drill 0.38)
  Top 0.178: D5.1 20.98,4.27 19.88,3.17 LOGIC.2 19.78,1.37 19.78,0.27 14.28,0.27 13.58,0.97 13.58,2.67 6.38,2.67 4.08,4.97 4.08,15.27 2.58,15.27 JP2.1 | ENC1.14 1.18,28.47 1.48,28.77 1.48,33.37 2.58,34.47 4.98,34.47 4.98,32.17 X1.2
  Route2 0.178: v21.48,22.97 21.68,22.77 21.68,14.17 24.88,10.97 24.88,7.37 19.88,2.37 LOGIC.2
  Route15 0.178: v21.48,22.97 20.98,22.97 19.28,21.27 18.38,21.27 8.58,31.07 6.08,31.07 5.08,32.07 X1.2
  Bottom 0.178: v21.48,22.97 23.68,22.97 23.98,23.27 SENSE.8
VDRIVER  (via drill 0.38)
  Route15 0.254: v24.08,8.07 24.08,7.87 18.78,2.57 16.88,2.57 15.78,1.47 14.88,1.47 LOGIC.4
  Bottom 0.254: 17.98,14.27 18.38,13.87 18.68,13.87 18.68,13.47 D2.3 | 17.98,14.27 16.08,14.27 15.68,13.87 DRV2.1 15.78,14.07 14.78,15.07 11.28,15.07 9.88,13.67 9.88,13.57 D1.3 9.78,13.37 9.78,12.97 8.88,12.07 | D3.3 27.58,13.57 27.58,14.37 24.68,14.37 24.18,13.87 DRV3.1 24.38,14.17 23.38,15.17 18.78,15.17 17.98,14.37 17.98,14.27 | 8.88,12.07 8.88,10.77 JP1.2 8.88,10.67 8.88,10.07 10.98,7.97 23.98,7.97 v24.08,8.07 | 8.88,12.07 7.48,12.07 DRV1.1
VUSB  (via drill 0.38)
  Top 0.178: v24.18,3.47 23.38,4.27 D5.2
  Bottom 0.178: v24.18,3.47 24.58,3.87 25.88,3.87 K1.1
W_GATE_HIGH  (via drill 0.38)
  Top 0.178: R5.1 19.68,36.77 17.68,36.77 R18.2 17.58,36.67 16.68,35.77 16.68,26.67 v15.18,26.67
  Route2 0.178: v12.78,21.47 12.78,24.27 v15.18,26.67
  Bottom 0.178: v12.78,21.47 13.18,21.07 22.88,21.07 22.88,18.97 DRV3.7
W_GATE_LOW  (via drill 0.38)
  Top 0.178: R19.2 17.68,42.27 19.48,42.27 R6.1 19.58,42.17 19.88,42.17 21.38,40.67 21.38,40.37 22.18,39.57 22.18,35.47 v23.88,33.77
  Route2 0.178: v19.38,18.17 17.98,19.57 17.98,25.77 23.88,31.67 v23.88,33.77
  Bottom 0.178: v19.38,18.17 19.58,18.17 20.28,18.87 DRV3.5
W_HIGH  (via drill 0.38)
  Top 0.178: v8.98,14.47 8.98,16.97 13.38,16.97 UC1.18
  Route15 0.178: v8.98,14.47 4.08,9.57 4.08,9.17 5.38,7.87 21.18,7.87 v22.38,9.07
  Bottom 0.178: v22.38,9.07 22.38,9.97 22.98,9.97 R11.1
W_LOW  (via drill 0.38)
  Top 0.178: v16.48,15.27 15.58,15.27 14.48,16.37 13.48,16.37 UC1.19
  Route2 0.178: v16.48,15.27 16.48,12.47 18.28,10.67 v18.28,10.37
  Bottom 0.178: v18.28,10.37 18.58,10.07 20.98,10.07 R12.1
W_PHASE
  Bottom 1.016: Q5.3 17.75,28.45 | Q5.2 Q5.1
  Bottom 1.676: Q5.2 17.75,28.45 X1.7 17.75,36.86 Q6.MB

### Text on the board
tNames: "MAY THE FORCE | BE WITH US" | -------------------------- | RHOBAN BLDC REV0
bNames: GND | V+ | MISO | MOSI | SCK | CS | VDRIVER | 3.3 | VCC | GND